# EAGLE schematic main (EAGLE 7.6.0)
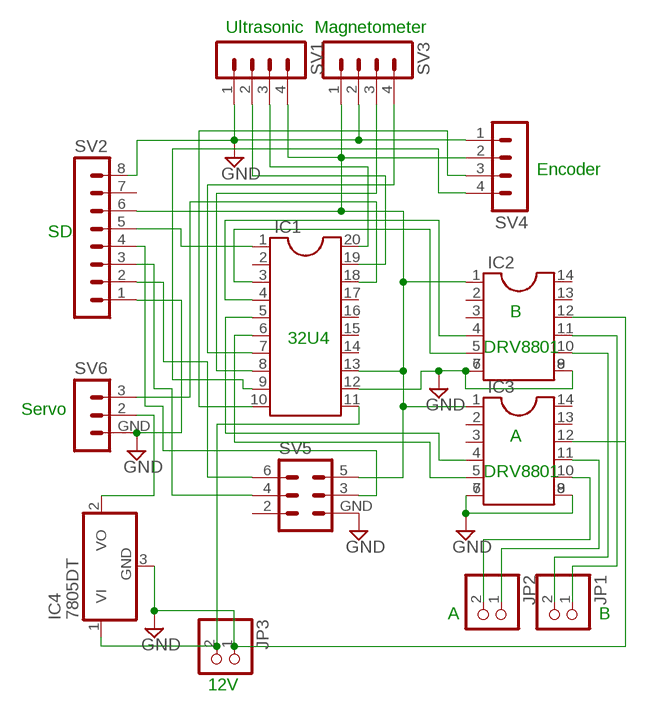
[diagram p0: schematic, sheet 1]

## Parts
IC1  DIL20S  [SOCKET-20]
IC2  DIL14  [DIL14]
IC3  DIL14  [DIL14]
IC4  7805DT  [TO252]
JP1  PINHD-1X2  [1X02]
JP2  PINHD-1X2  [1X02]
JP3  PINHD-1X2  [1X02]
SV1  MA04-1  [MA04-1]
SV2  MA08-1  [MA08-1]
SV3  MA04-1  [MA04-1]
SV4  MA04-1  [MA04-1]
SV5  MA03-2  [MA03-2]
SV6  MA03-1  [MA03-1]

## Nets
GND: IC1.12 IC2.6 IC2.7 IC2.8 IC2.12 IC3.6 IC3.8 IC3.12 IC4.3(GND) JP3.1 SV1.1 SV2.1 SV3.2 SV4.1 SV5.GND SV6.GND
N$1: IC3.10 JP2.2
N$2: IC3.11 JP2.1
N$3: IC2.10 JP1.2
N$4: IC2.11 JP1.1
N$5: IC1.11 IC4.1(VI) JP3.2
N$6: IC4.2(VO) SV6.2
N$7: IC1.8 SV3.3
N$8: IC1.13 IC2.1 IC3.1 SV1.4 SV2.6 SV3.1 SV4.2 SV5.5
N$9: IC1.5 IC3.4
N$10: IC1.6 IC3.5
N$11: IC1.4 IC2.4
N$12: IC1.3 IC2.5
N$13: IC1.18 SV6.3
N$14: IC1.7 SV3.4
N$15: IC1.19 SV1.2
N$16: IC1.20 SV1.3
N$17: IC1.10 SV4.3
N$18: IC1.9 SV4.4
N$19: IC1.1 SV2.5
N$20: SV2.2 SV5.6
N$21: SV2.3 SV5.4
N$22: SV2.4 SV5.3
Unconnected: IC1.2 IC1.14 IC1.15 IC1.16 IC1.17 IC2.2 IC2.3 IC2.9 IC2.13 IC2.14 IC3.2 IC3.3 IC3.7 IC3.9 IC3.13 IC3.14 SV2.7 SV2.8 SV5.2

## Notes on the sheet
- Ultrasonic | Magnetometer
- Encoder
- SD
- B
- 32U4
- DRV8801
- Servo
- A
- DRV8801
- A | B
- 12V

## Library data of the parts
IC1 = ic-package:DIL20: Dual In Line / Socket
IC2 IC3 = ic-package:DIL14: Dual In Line / Socket
IC4 = linear:78*: Positive VOLTAGE REGULATOR Source: http://cache.national.com/ds/LM/LM78L05.pdf http://www.fairchildsemi.com/ds/LM/LM7805.pdf
JP1-JP3 = pinhead:PINHD-1X2: PIN HEADER
SV1 SV3 SV4 = con-lstb:MA04-1: PIN HEADER; OC_FARNELL: unknown; OC_NEWARK: unknown
SV2 = con-lstb:MA08-1: PIN HEADER; OC_FARNELL: unknown; OC_NEWARK: unknown
SV5 = con-lstb:MA03-2: PIN HEADER; OC_FARNELL: unknown; OC_NEWARK: unknown
SV6 = con-lstb:MA03-1: PIN HEADER; OC_FARNELL: unknown; OC_NEWARK: unknown